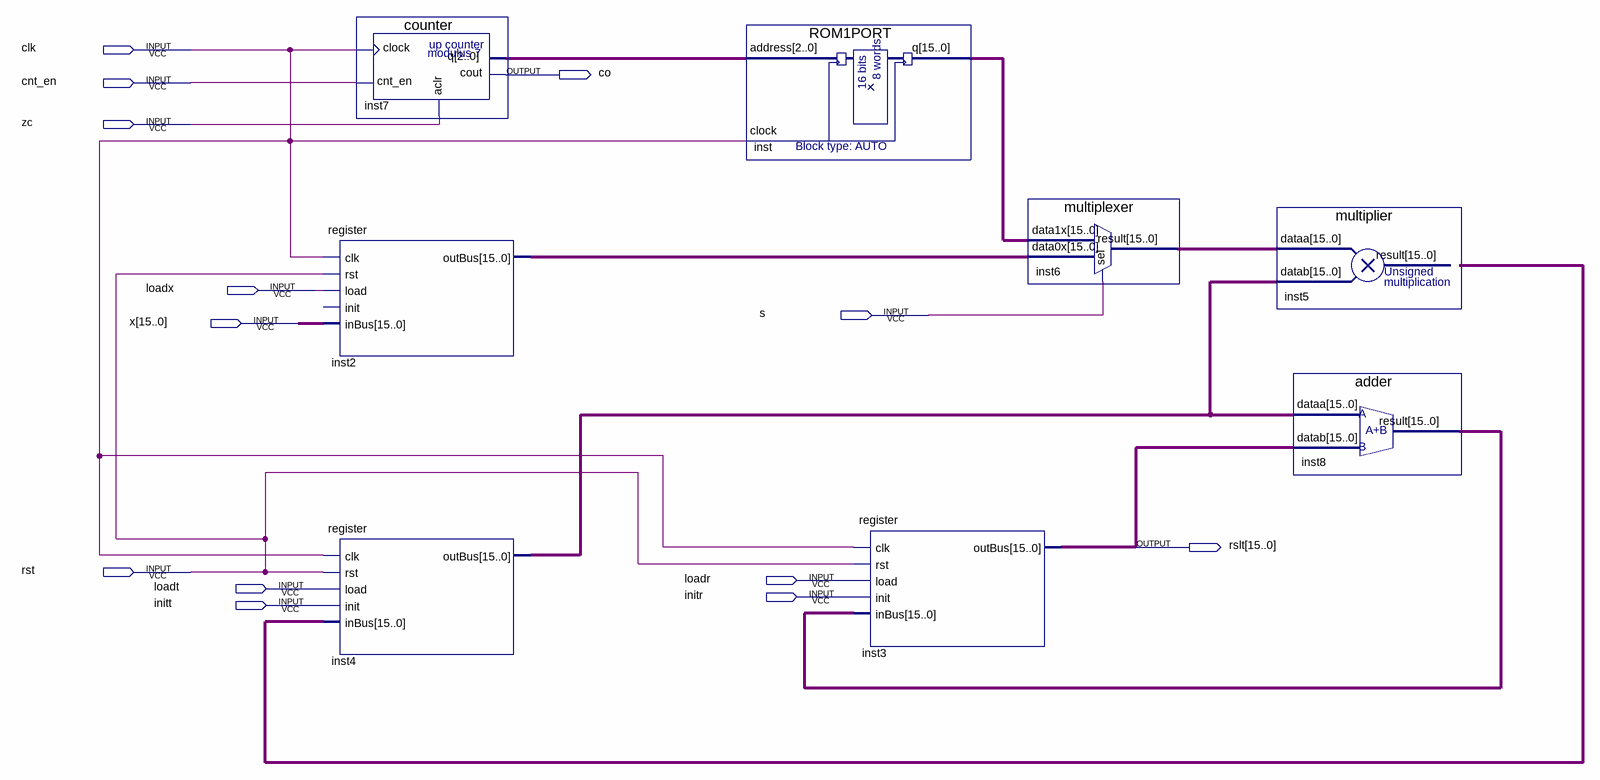
[diagram p0: schematic sheet]
// Quartus schematic tanx.bdf as structural Verilog: 8 symbols, 13 pins
module tanx (
  input  clk,
  input  cnt_en,
  input  zc,
  input  loadx,
  input  s,
  input  [15:0] x,
  input  rst,
  input  loadr,
  input  loadt,
  input  initr,
  input  initt,
  output co,
  output [15:0] rslt
);

  wire [2:0] inst7_q;
  wire [15:0] inst2_outbus, inst4_outbus, inst5_result, inst6_result, inst8_result, inst_q;

  register inst2 (.clk(clk), .rst(rst), .load(loadx), .inBus(x), .outBus(inst2_outbus));  // open: init
  register inst4 (.clk(clk), .rst(rst), .load(loadt), .init(initt), .inBus(inst5_result), .outBus(inst4_outbus));
  counter inst7 (.clock(clk), .cnt_en(cnt_en), .aclr(zc), .cout(co), .q(inst7_q));
  ROM1PORT inst (.address(inst7_q), .clock(clk), .q(inst_q));
  register inst3 (.clk(clk), .rst(rst), .load(loadr), .init(initr), .inBus(inst8_result), .outBus(rslt));
  multiplexer inst6 (.data1x(inst_q), .data0x(inst2_outbus), .sel(s), .result(inst6_result));
  multiplier inst5 (.dataa(inst6_result), .datab(inst4_outbus), .result(inst5_result));
  adder inst8 (.dataa(inst4_outbus), .datab(rslt), .result(inst8_result));
endmodule
